# Altium schematic sheet Ports.SchDoc
size 420 x 297 mm; SheetNumber: 21; SheetTotal: 21
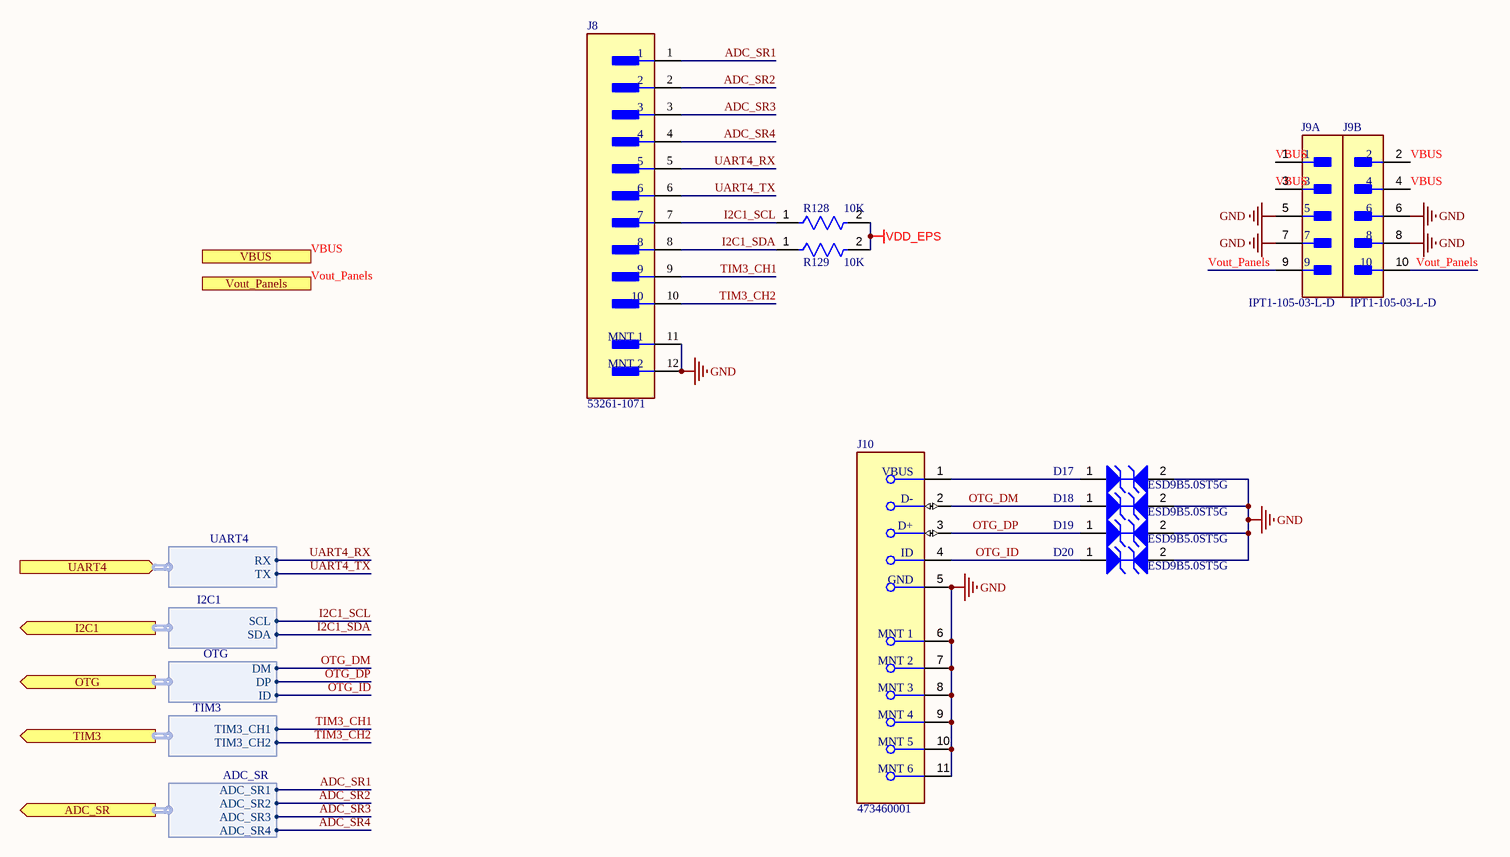
[diagram p0: Ports.SchDoc]

## Parts
D17  ESD9B5.0ST5G  [ONSC-SOD-923-2-514AB-01_V]
D18  ESD9B5.0ST5G  [ONSC-SOD-923-2-514AB-01_V]
D19  ESD9B5.0ST5G  [ONSC-SOD-923-2-514AB-01_V]
D20  ESD9B5.0ST5G  [ONSC-SOD-923-2-514AB-01_V]
J8  53261-1071  [FP-532611071-MFG]
J9  IPT1-105-03-L-D  [FP-IPT1-105-03-L-D-MFG]  (parts A,B of 2)
J10  473460001  [FP-473460001-MFG]
R128  10K  [FP-RK73B1J-MFG]
R129  10K  [FP-RK73B1J-MFG]

## Ports
ADC_SR (out, harness ADC_SR), I2C1 (out, harness I2C1), OTG (out, harness OTG), TIM3 (out, harness TIM3), UART4 (in, harness UART4), VBUS, Vout_Panels

## Harnesses
UART4: TX, RX
I2C1: SDA, SCL
OTG: DM, DP, ID
TIM3: TIM3_CH2, TIM3_CH1
ADC_SR: ADC_SR1, ADC_SR2, ADC_SR3, ADC_SR4

## Nets
GND: D17.2(A2) D18.2(A2) D19.2(A2) D20.2(A2) J8.11(MNT_1) J8.12(MNT_2) J9.5 J9.6 J9.7 J9.8 J10.5(GND) J10.6(MNT_1) J10.7(MNT_2) J10.8(MNT_3) J10.9(MNT_4) J10.10(MNT_5) J10.11(MNT_6)
VDD_EPS: R128.2 R129.2
ADC_SR1: J8.1 ; port ADC_SR.ADC_SR1
ADC_SR2: J8.2 ; port ADC_SR.ADC_SR2
ADC_SR3: J8.3 ; port ADC_SR.ADC_SR3
ADC_SR4: J8.4 ; port ADC_SR.ADC_SR4
I2C1_SCL: J8.7 R128.1 ; port I2C1.SCL
I2C1_SDA: J8.8 R129.1 ; port I2C1.SDA
OTG_DM: D18.1(A1) J10.2(D-) ; port OTG.DM
OTG_DP: D19.1(A1) J10.3(D+) ; port OTG.DP
OTG_ID: D20.1(A1) J10.4(ID) ; port OTG.ID
TIM3_CH1: J8.9 ; port TIM3.TIM3_CH1
TIM3_CH2: J8.10 ; port TIM3.TIM3_CH2
UART4_RX: J8.5 ; port UART4.RX
UART4_TX: J8.6 ; port UART4.TX
VBUS: J9.1 J9.2 J9.3 J9.4 ; port VBUS
Vout_Panels: J9.9 J9.10 ; port Vout_Panels
NetD17_1: D17.1(A1) J10.1(VBUS)

## Notes on the sheet
- THIS DOCUMENT AND THE DATA DISCLOSED HEREIN OR
- HEREWITH IS THE PROPERTY OF ALTIUM LIMITED AND MAY
- DWG NO:
- REVISION
- REV:
- DESCRIPTION
- DATE
- APPROVED
- BE FREELY DISTRIBUTED IN WHOLE. NO RIGHTS ARE
- RESERVED OR EXPRESS OR IMPLIED WARANTEE GIVEN.
- ENG:
- APPROVALS
- PROJECT
- DSN:
- CHK:
- REFERENCE DOCUMENTS
- PROJECT REVISION:
- TITLE
- DOCUMENT REVISION:
- DESIGN ITEM:
- BOM:
- FAB DWG:
- PCB DWG:
- ASSY DWG:
- SCALE:
- A3
- SIZE
- CAGE CODE
- FILE NAME
- DWG NO.
- SHEET
- OF
- REV

## Library data of the parts
D17-D20 = CMP-1063-00119-1: Transient Voltage Suppressor, Micro-Packaged Diode for ESD Protection, 2-Pin SOD-923, Pb-Free, Tape and Reel; Manufacturer: On Semiconductor; Number of Lines: 1; Direction: Bidirectional; V(BR) Min (V): 5.8; VRWM Max (V): 5; Packing: Tape and Reel; PackageDescription: 2-Pin SOD, Body 0.8 x 0.6 mm; IR Max (uA): 1; ComponentLink3Description: Package Specification; PartNumber: ESD9B5.0ST5G; ComponentLink1URL: http://www.onsemi.com/; RoHS: Pb-Free; Mounting Technology: Surface Mount; DatasheetVersion: Rev. 2; ComponentLink2URL: http://www.onsemi.cn/pub_link/Collateral/ESD9B-D.PDF; ComponentLink3URL: http://www.onsemi.com/pub_link/Collateral/514AB.PDF; PackageReference: SOD-923-2-514AB-01; PackageVersion: Rev. C, 03/2011; ComponentLink1Description: Manufacturer URL; ComponentLink2Description: Datasheet
J8 = CMP-00257-00655315-1: 53261-1071 1.25mm (.049") Pitch PicoBlade Header, Surface Mount, Right Angle, Lead-free, 10 Circuits; Manufacturer Lifecycle Status: ACTIVE; NexarPartId: 655315; Number of Circuits: 10; Gender: Male; Contact Resistance: 20mΩ; Voltage Rating: 125V; Current Rating: 1A; Glow Wire Compliant: Non-compliant; Insulation Resistance: 100MΩ; Plating: Tin; Contact Plating: Tin; Orientation: Right Angle; Number of Pins: 10; Country of Origin: SG; Housing Material: Nylon; Number of Contacts: 10; Schedule B: 8536694040, 8536694040; Height: 3.6mm; Contact Material: Tin; Max Operating Temperature: 85°C; Lead Pitch: 1.25mm; Number of Rows: 1; Lead Free: Lead Free; Packaging: Cut Tape; Pitch: 1.25mm; Min Operating Temperature: -40°C; Voltage Rating (AC): 125V; Termination: SMD/SMT, Solder; Flammability Rating: UL94 V-0; Number of Positions: 10; Width: 4.2mm; Radiation Hardening: No; Voltage Rating (DC): 125V; REACH SVHC: Unknown; Mount: Surface Mount; RoHS: Compliant; Lifecycle Status: Production; Length: 17.6mm
J9 = CMP-02770-000009-1: CONN HEADER VERT 10POS 2.54MM; Manufacturer: Samtec; Standoff Height: 0.38mm; Conn Orientation: Vertical; Number Of Contacts: 10; Voltage Rating: 1095V; Conn Gender: Male; Package: 0; Digikey Description: CONN HEADER VERT 10POS 2.54MM; Device Class L3: unset; Height: 11.43mm; Pitch: 2.54mm; Device Class L1: Connectors; Lead Free: Yes; Device Class L2: Power Connectors; ComponentLink2Description: Datasheet; Temperature Range Low: -55°C; Octopart: https://octopart.com/ipt1-105-03-l-d-samtec-19544968; ComponentLink2URL: http://suddendocs.samtec.com/prints/ipt1-1xx-xx-xx-d-xx-mkt.pdf; Temperature Range High: +125°C; Footprint Url: http://suddendocs.samtec.com/prints/ipt1-1xx-xx-x-d-xxx_ipt1-1xx-xx-x-d-ra-xxx-mkt.pdf; Temperature: -55°C to +125°C; Manufacturer Part Number: IPT1-105-03-L-D; Contact Material: Gold,Nickel; Category: Conn; Automotive: No; RoHS: TRUE
J10 = CMP-2000-05246-2: CONN RCPT USB2.0 MICRO B SMD R/A; Manufacturer: Molex; Conn Orientation: Right Angle; Is Female: yes; Shielding: true; Pitch: 0.65mm; Number Of Contacts: 5; Voltage Rating: 30V; Current Rating: 1.8A; Device Class L2: USB Connectors; Digikey Description: CONN RCPT USB2.0 MICRO B SMD R/A; Height: 2.945mm; RoHS: TRUE; ComponentLink2Description: Datasheet; Octopart: https://octopart.com/47346-0001-molex-7164928; Automotive: No; Package: 0; Category: Conn; Device Class L1: Connectors; Usb Standard: USB 2.0; Temperature: -30°C to +85°C; Temperature Range Low: -30°C; Footprint Url: https://www.molex.com/pdm_docs/sd/473460001_sd.pdf; ComponentLink2URL: https://www.molex.com/webdocs/datasheets/pdf/en-us/0473460001_IO_CONNECTORS.pdf; Lead Free: Yes; Manufacturer Part Number: 473460001; Contact Material: Gold,Nickel; Temperature Range High: +85°C; Device Class L3: unset
R128 R129 = CMP-2000-01851-2: RES 10K OHM 5% 1/10W 0603; Temperature Coefficient: 200ppm/°C; Voltage Rating: 50V; Power Rating: 100mW; Resistance: 10kR; Length: 1.6mm; Lead Free: Lead Free; Resistance Tolerance: 5%; Case Code (Metric): 1608; Width: 0.8mm; Height: 0.45mm; Max Operating Temperature: 155°C; RoHS Compliant: Yes; Resistor Type: Thick Film; Min Operating Temperature: -55°C; Case Code (Imperial): 0603; Technology: THICK FILM; Package Quantity: 5000; Tolerance: 5%; Case/Package: 0603; Voltage Rating (DC): 50V; Depth: 0.8mm; Packaging: Tape and Reel; Number of Pins: 2; Construction: Rectangular; Series: RK73B; Military Standard: Not; Termination: SMD/SMT